# Altium project Edge_Card_Ucc28951.PrjPcb (part 2 of 3)

## Sheet MCU_CAN.SchDoc
size C
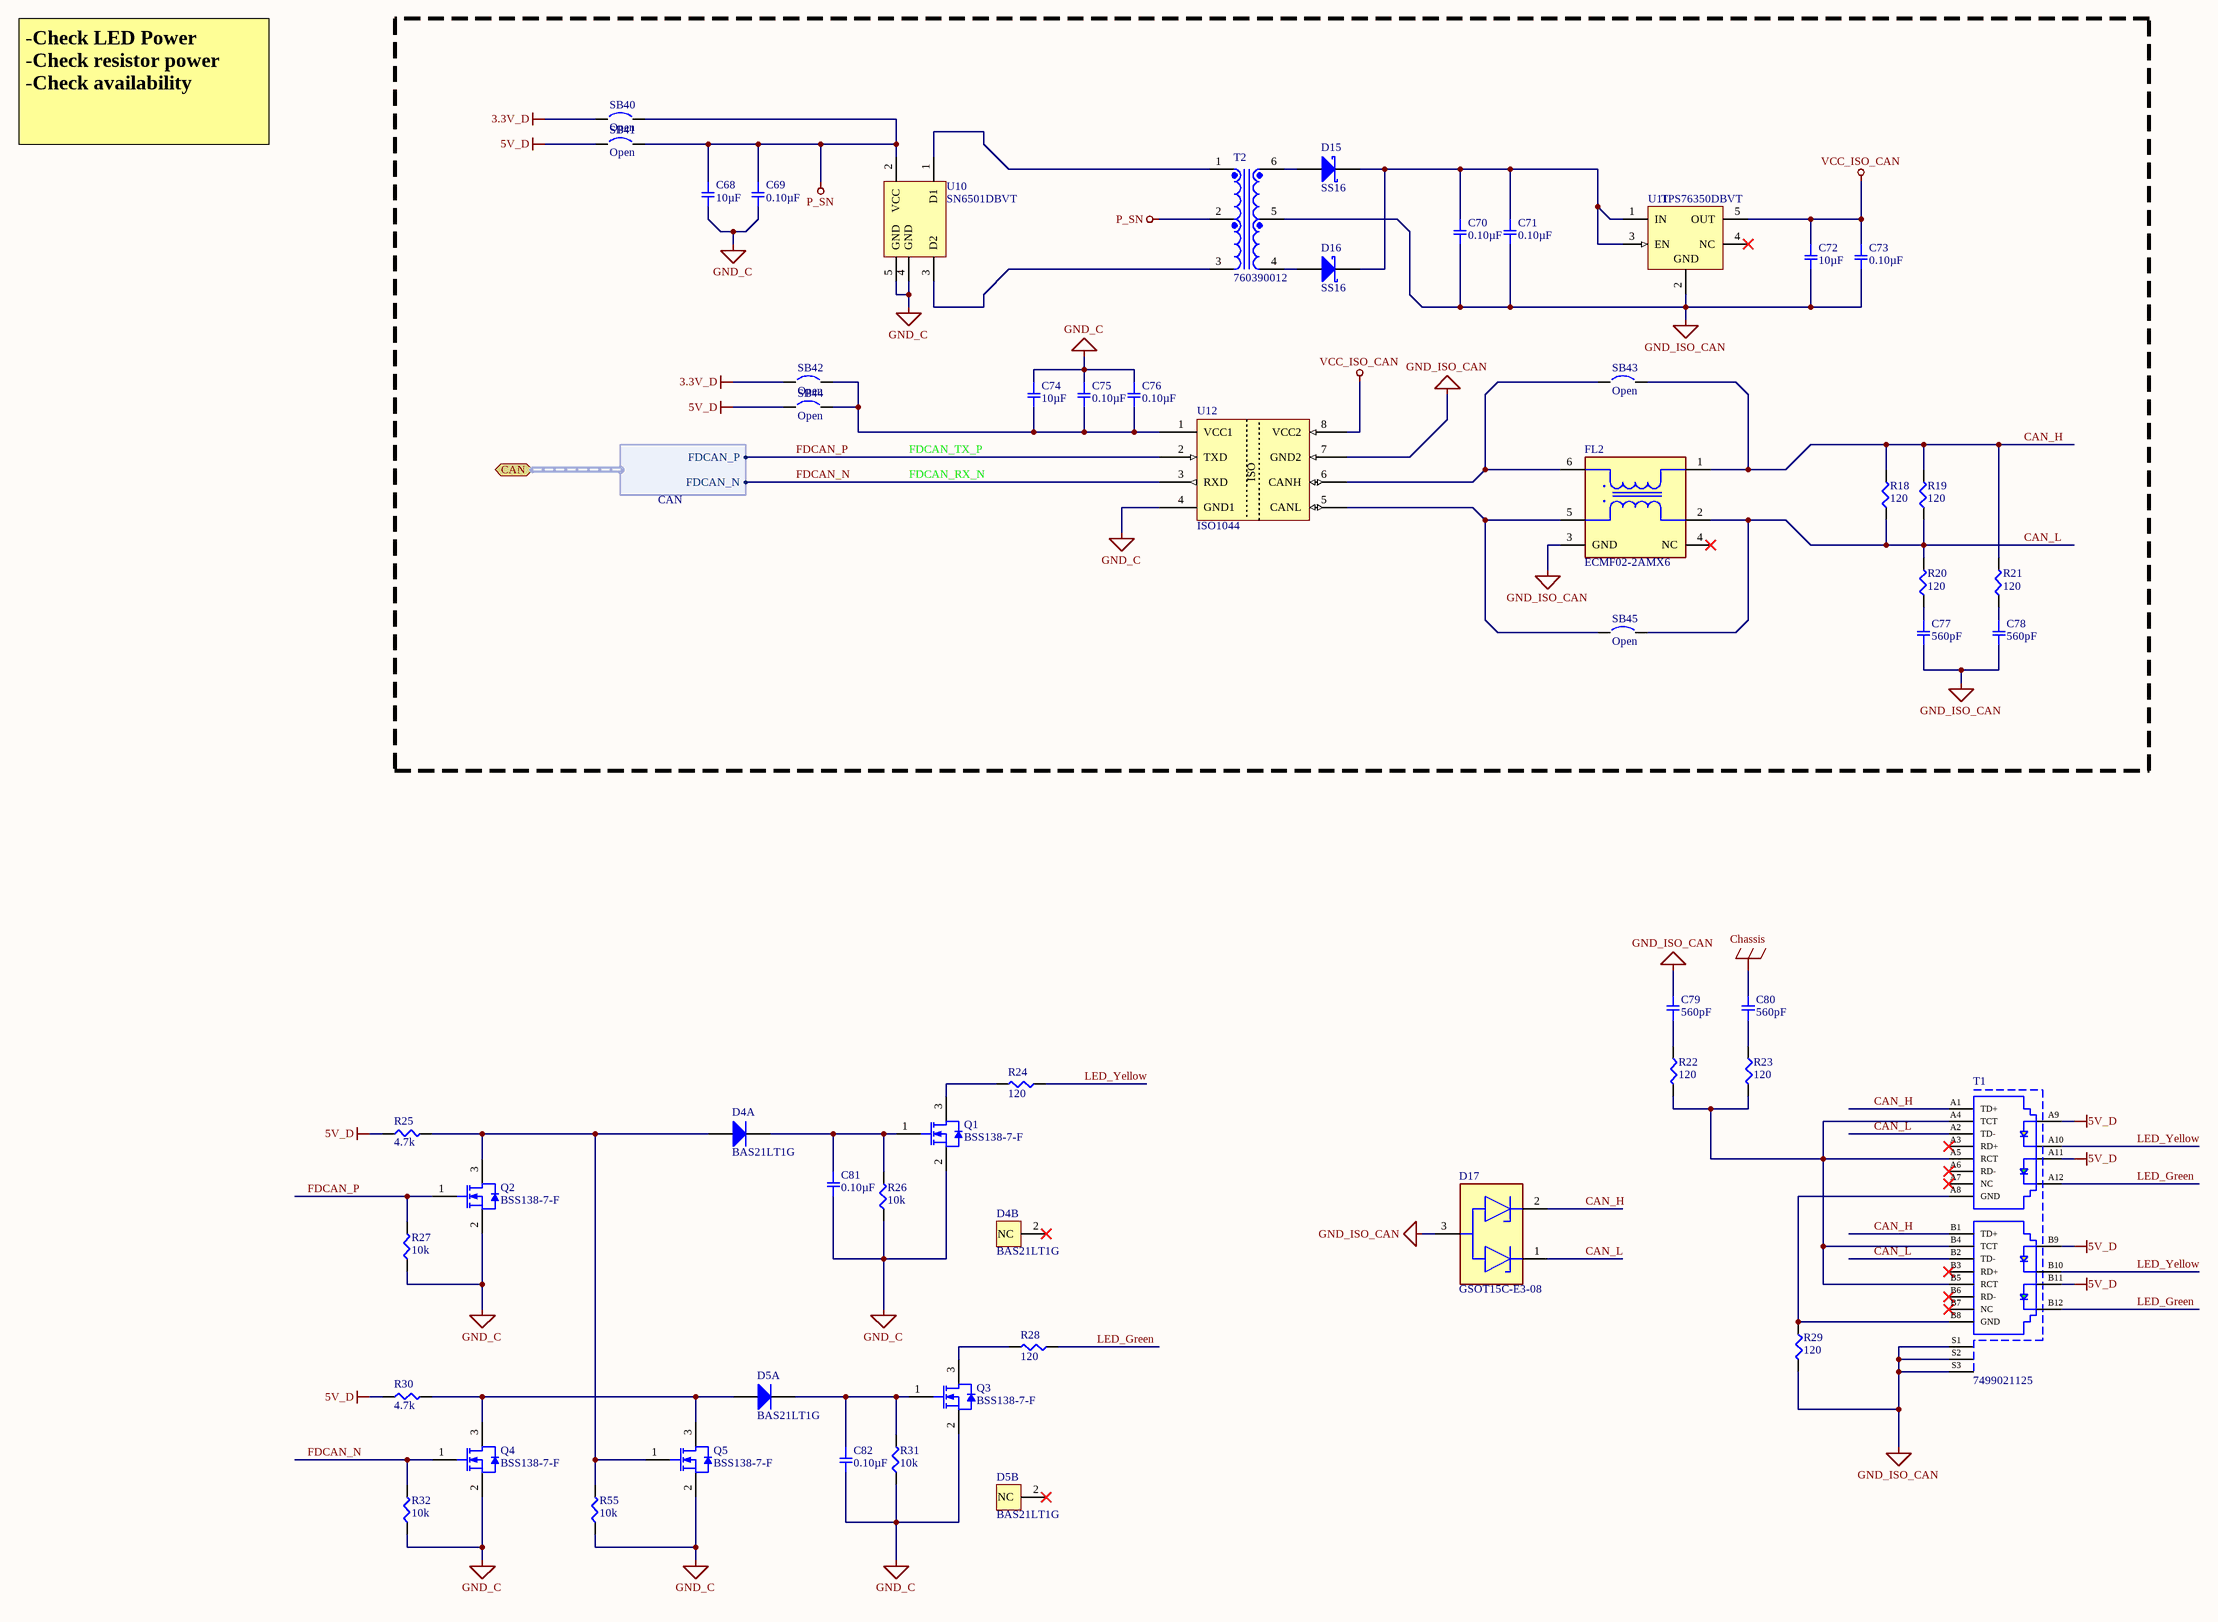
[diagram p9: MCU_CAN.SchDoc]

### Parts
C68  10µF  [SMD-0805C]
C69  0.10µF  [SMD-0805C]
C70  0.10µF  [SMD-0805C]
C71  0.10µF  [SMD-0805C]
C72  10µF  [SMD-0805C]
C73  0.10µF  [SMD-0805C]
C74  10µF  [SMD-0805C]
C75  0.10µF  [SMD-0805C]
C76  0.10µF  [SMD-0805C]
C77  560pF  [SMD-0805C]
C78  560pF  [SMD-0805C]
C79  560pF  [SMD-0805C]
C80  560pF  [SMD-0805C]
C81  0.10µF  [SMD-0805C]
C82  0.10µF  [SMD-0805C]
D4  BAS21LT1G  [ONSC-SOT-23-3-318-08_V]  (parts A,B of 2)
D5  BAS21LT1G  [ONSC-SOT-23-3-318-08_V]  (parts A,B of 2)
D15  SS16  [FAIR-SMA-2_B_V]
D16  SS16  [FAIR-SMA-2_B_V]
D17  GSOT15C-E3-08  [FP-6_541-5014_01-4-MFG]
FL2  ECMF02-2AMX6  [FP-QFN-6L-MFG]
Q1  BSS138-7-F  [DIOD-SOT23-3_V]
Q2  BSS138-7-F  [DIOD-SOT23-3_V]
Q3  BSS138-7-F  [DIOD-SOT23-3_V]
Q4  BSS138-7-F  [DIOD-SOT23-3_V]
Q5  BSS138-7-F  [DIOD-SOT23-3_V]
R18  120  [SMD-0603-RES]
R19  120  [SMD-0603-RES]
R20  120  [SMD-0603-RES]
R21  120  [SMD-0603-RES]
R22  120  [SMD-0603-RES]
R23  120  [SMD-0603-RES]
R24  120  [SMD-0603-RES]
R25  4.7k  [SMD-0603-RES]
R26  10k  [SMD-0603-RES]
R27  10k  [SMD-0603-RES]
R28  120  [SMD-0603-RES]
R29  120  [SMD-0603-RES]
R30  4.7k  [SMD-0603-RES]
R31  10k  [SMD-0603-RES]
R32  10k  [SMD-0603-RES]
R55  10k  [SMD-0603-RES]
SB40  Open  [SB_0603]  (no BOM)
SB41  Open  [SB_0603]  (no BOM)
SB42  Open  [SB_0603]  (no BOM)
SB43  Open  [SB_0603]  (no BOM)
SB44  Open  [SB_0603]  (no BOM)
SB45  Open  [SB_0603]  (no BOM)
T1  7499021125  [7499021125]
T2  760390012  [WE-760390012-6_V]
U10  SN6501DBVT  [SOT95P278X110-5N]
U11  TPS76350DBVT  [DBV0005A_M]
U12  ISO1044  [SOIC127P570X175_HS-9N - No Thermal]

### Ports
CAN (bidir, harness CAN)

### Harnesses
CAN: FDCAN_P, FDCAN_N

### Nets
3.3V_D: SB40.1 SB42.1
5V_D: R25.1 R30.1 SB41.1 SB44.1 T1.A9 T1.A11 T1.B9 T1.B11
Chassis: C80.2
GND_C: C68.2 C69.2 C74.1 C75.1 C76.1 C81.2 C82.2 Q1.2(S) Q2.2(S) Q3.2(S) Q4.2(S) Q5.2(S) R26.1 R27.1 R31.1 R32.1 R55.1 U10.4(GND) U10.5(GND) U12.4(GND1)
GND_ISO_CAN: C70.2 C71.2 C72.2 C73.2 C77.2 C78.2 C79.2 D17.3(COMMON_ANODE) FL2.3(GND) R29.2 T1.S1(Shield) T1.S2(Shield) T1.S3(Shield) T2.5 U11.2(GND) U12.7(GND2)
P_SN: C68.1 C69.1 SB40.2 SB41.2 T2.2 U10.2(VCC)
VCC_ISO_CAN: C72.1 C73.1 U11.5(OUT) U12.8(VCC2)
CAN_H: D17.2(2_CATHODE) FL2.1(D+) R18.2 R19.2 R21.2 SB43.2 T1.A1(TD+) T1.B1(TD+)
CAN_L: D17.1(1_CATHODE) FL2.2(D-) R18.1 R19.1 R20.2 SB45.2 T1.A2(TD-) T1.B2(TD-)
FDCAN_N: Q4.1(G) R32.2 U12.3(RXD) ; port CAN.FDCAN_N
FDCAN_P: Q2.1(G) R27.2 U12.2(TXD) ; port CAN.FDCAN_P
LED_Green: R28.1 T1.A12 T1.B12
LED_Yellow: R24.1 T1.A10 T1.B10
NetC70_1: C70.1 C71.1 D15.2(K) D16.2(K) U11.1(IN) U11.3(EN)
NetC74_2: C74.2 C75.2 C76.2 SB42.2 SB44.2 U12.1(VCC1)
NetC77_1: C77.1 R20.1
NetC78_1: C78.1 R21.1
NetC79_1: C79.1 R22.1
NetC80_1: C80.1 R23.1
NetC81_1: C81.1 D4.3(K) Q1.1(G) R26.2
NetC82_1: C82.1 D5.3(K) Q3.1(G) R31.2
NetD4_1: D4.1(A) Q2.3(D) Q5.1(G) R25.2 R55.2
NetD5_1: D5.1(A) Q4.3(D) Q5.3(D) R30.2
NetD15_1: D15.1(A) T2.6
NetD16_1: D16.1(A) T2.4
NetFL2_5: FL2.5(D-) SB45.1 U12.5(CANL)
NetFL2_6: FL2.6(D+) SB43.1 U12.6(CANH)
NetQ1_3: Q1.3(D) R24.2
NetQ3_3: Q3.3(D) R28.2
NetR22_2: R22.2 R23.2 T1.A4(TCT) T1.A5(RCT) T1.B4(TCT) T1.B5(RCT)
NetR29_1: R29.1 T1.A8(GND) T1.B8(GND)
NetT2_1: T2.1 U10.1(D1)
NetT2_3: T2.3 U10.3(D2)

Not connected (* = marked no-connect by the designer): D4 2(NC)*; D5 2(NC)*; FL2 4(NC)*; T1 A3(RD+)* A6(RD-)* A7(NC)* B3(RD+)* B6(RD-)* B7(NC)*; U11 4(NC)*

### Notes on the sheet
- -Check LED Power                                 -Check resistor power                             -Check availability
- FDCAN_RX_N
- FDCAN_TX_P
- (in symbol ISO1044) ISO

### Library data of the parts
C68 C72 C74 = GCM21BR71A106KE22L: CAP CER 10UF 10V X7R 0805; Manufacturer: Murata Electronics North America; Factory Stock: 0; Unit Price (USD): 0.49; Minimum Quantity: 1; Tolerance: ±10%; Datasheets: http://www.murata.com/~/media/webrenewal/support/library/catalog/products/capacitor/mlcc/c03e.ashx; Image: //media.digikey.com/photos/Murata%20Photos/NCP,GCM%20SERIES%200805.jpg; Digi-Key Part Number: 490-10674-1-ND; Part Number: GCM21BR71A106KE22L; Quantity Available: 125344; @ qty: 0; Packaging: Cut Tape (CT); Series: GCM; Part Status: Active; Value: 10µF; Voltage: 10V; Temperature Coefficient: X7R; Operating Temperature: -55°C ~ 125°C; Features: -; Ratings: AEC-Q200; Applications: Automotive; Mounting Type: Surface Mount, MLCC; Package / Case: 0805 (2012 Metric); Size / Dimension: 0.079" L x 0.049" W (2.00mm x 1.25mm); Height - Seated (Max): -; Thickness (Max): 0.055" (1.40mm); Lead Spacing: -; Lead Style: -
C69-C71 C73 C75 C76 C81 C82 = GCJ21BR72A104KA01L: CAP CER 0.1UF 100V X7R 0805; Manufacturer: Murata Electronics North America; Factory Stock: 0; Unit Price (USD): 0.32; Minimum Quantity: 1; Tolerance: ±10%; Datasheets: http://www.murata.com/~/media/webrenewal/support/library/catalog/products/capacitor/mlcc/c03e.ashx; Image: //media.digikey.com/Renders/Murata%20Renders/0805%20(2012%20Metric)%20.85mm.jpg; Digi-Key Part Number: 490-5825-1-ND; Part Number: GCJ21BR72A104KA01L; Quantity Available: 1873; @ qty: 0; Packaging: Cut Tape (CT); Series: GCJ; Part Status: Active; Value: 0.10µF; Voltage: 100V; Temperature Coefficient: X7R; Operating Temperature: -55°C ~ 125°C; Features: Soft Termination; Ratings: AEC-Q200; Applications: Automotive, Boardflex Sensitive; Mounting Type: Surface Mount, MLCC; Package / Case: 0805 (2012 Metric); Size / Dimension: 0.079" L x 0.049" W (2.00mm x 1.25mm); Height - Seated (Max): -; Thickness (Max): 0.049" (1.25mm); Lead Spacing: -; Lead Style: -
C77-C80 = GRM216R71H561KA01D: CAP CER 560PF 50V X7R 0805; Manufacturer: Murata Electronics North America; Factory Stock: 0; Unit Price (USD): 0.12; Minimum Quantity: 1; Tolerance: ±10%; Datasheets: http://www.murata.com/~/media/webrenewal/support/library/catalog/products/capacitor/mlcc/c02e.pdf; Image: //media.digikey.com/Renders/Murata%20Renders/0805%20(2012%20Metric)%20.85mm.jpg; Digi-Key Part Number: 490-11575-1-ND; Part Number: GRM216R71H561KA01D; Quantity Available: 7711; @ qty: 0; Packaging: Cut Tape (CT); Series: GRM; Part Status: Active; Value: 560pF; Voltage: 50V; Temperature Coefficient: X7R; Operating Temperature: -55°C ~ 125°C; Features: -; Ratings: -; Applications: General Purpose; Mounting Type: Surface Mount, MLCC; Package / Case: 0805 (2012 Metric); Size / Dimension: 0.079" L x 0.049" W (2.00mm x 1.25mm); Height - Seated (Max): -; Thickness (Max): 0.028" (0.70mm); Lead Spacing: -; Lead Style: -
D4 D5 = CMP-1679-00004-5: High Voltage Switching Diode, 250 V, 3-Pin SOT-23 (318-08), Pb-Free, Tape and Reel; Manufacturer: ON Semiconductor; ComponentLink1Description: Manufacturer URL; Mounting Technology: Surface Mount; ComponentLink2Description: Datasheet; PackageVersion: Rev. AP, 11/2009; ComponentLink3URL: http://www.onsemi.cn/pub_link/Collateral/318-08.PDF; Min Operating Temperature: -65 degC; DatasheetVersion: Rev. 16, 03/2014; RoHSCompliant: true; Max Operating Temperature: 150 degC; ComponentLink3Description: Package Specification; Packaging: Tape and Reel; Mount: Surface Mount; PackageDescription: 3-Pin Small Outline Transistor, Body 2.9 x 1.3 mm, Pitch 0.95 mm; PackageReference: SOT-23 (318-08); ComponentLink1URL: http://www.onsemi.com/; ComponentLink2URL: http://www.onsemi.com/pub_link/Collateral/BAS19LT1-D.PDF
D15 D16 = CMP-2000-07149-1: Schottky Rectifier, 700 mV, -65 to 125 degC, 2-Pin SMA, RoHS, Tape and Reel; Manufacturer: FairchildSemiconductor; Type: SchottkyDiode; Peak Average Forward Current: 1@Ta=75CA; Peak Reverse Current: 200uA; Peak Non-Repetitive Surge Current: 40A; Configuration: Single; Peak Forward Voltage: 0.7V; Peak Reverse Repetitive Voltage: 60V; Package: 2DO-214AC; Datasheet URL: http://www.mouser.com/ds/2/149/SS16-196707.pdf; Package Description: 2-Pin Surface Mount Device, Body 4.375 x 2.725 mm; Packaging: Tape&Reel; Package Reference: SMA-2; Mounting: SurfaceMount; Operating Temperature: -65to125°C; Datasheet Version: Rev. 1.9, 01/2015; Mounting Technology: SurfaceMount; Category: Rectifier; Manufacturer URL: https://www.fairchildsemi.com/
D17 = CMP-02577-000002-1: TVS DIODE 15V 28.8V SOT23-3; Manufacturer: Vishay; Peak Pulse Power: 345W; Automotive Grade: Grade 0; Max Junction Temp: +150°C; Value: 35pF; Breakdown Voltage: 16.5V; Peak Pulse Current: 8A; Number Of Channels: 2; Clamping Voltage: 24.8V; Direction: Unidirectional; Category: Diode; Device Class L3: unset; ComponentLink2URL: http://www.vishay.com/docs/85824/gsot03c.pdf; Lead Free: Yes; Reverse Standoff Voltage: 15V; Mouser Description: GSOT15C Series 12.3 V 120 pF SMT Bi-Directional ESD Protection Diode - SOT-23; Height: 1.15mm; Temperature Range High: +150°C; Automotive: Yes; RoHS: TRUE; ComponentLink2Description: Datasheet; Capacitance: 35pF; Device Class L1: Circuit Protection; Manufacturer Part Number: GSOT15C-E3-08; Package: 6.541-5014.01-4; Octopart: https://octopart.com/gsot15c-e3-08-vishay-46467627; Device Class L2: TVS Diodes; Temperature: -55°C to +150°C; Temperature Range Low: -55°C; Digikey Description: TVS DIODE 15V 28.8V SOT23-3
FL2 = CMP-12075-000001-1: CMC 200MA 2LN SMD ESD; Manufacturer: STMicroelectronics; Standoff Height: 0mm; Max Junction Temp: +125°C; Series Resistance: 2.5Ω; Device Class L2: EMI / RFI Components; Device Class L1: Passive Components; Height: 0.55mm; Lead Free: Yes; Package: QFN-6L; Temperature Range Low: -55°C; Octopart: https://octopart.com/ecmf02-2amx6-stmicroelectronics-44353078; Mouser Description: TVS Diodes / ESD Suppressors ESD Mode Filter 6GHz USB 2.0 MIPI 8kV; Device Class L3: Common Mode Chokes; ComponentLink2URL: https://www.st.com/resource/en/datasheet/ecmf02-2amx6.pdf; Ipc Land Pattern Name: DFN170X150X50-6; ComponentLink2Description: Datasheet; Automotive: No; Temperature Range High: +125°C; Temperature: -55°C to +125°C; RoHS: TRUE; Digikey Description: CMC 200MA 2LN SMD ESD; Manufacturer Part Number: ECMF02-2AMX6; Category: Filter
Q1-Q5 = CMP-2000-04930-1: N-Channel Enhancement Mode Mosfet, 50 V, 0.2 A, -55 to 150 degC, 3-Pin SOT23, RoHS, Tape and Reel; Manufacturer: Diodes Inc; Brand: DiodesIncorporated; Unit Weight: 0.000282oz; Pd - Power Dissipation: 300mW; Id - Continuous Drain Current: 200mA; Rds On - Drain-Source Resistance: 3.5Ohms; Vgs - Gate-Source Voltage: 20V; Number of Channels: 1Channel; Vds - Drain-Source Breakdown Voltage: 50V; Transistor Type: 1N-Channel; Typical Turn-Off Delay Time: 20ns; Configuration: Single; Mounting Style: SMD/SMT; Height: 1mm; Package Description: 3-Pin Small Outline Transistor, Body 2.9 x 1.3 mm, Pitch 0.96 mm; Datasheet Version: Rev. 20-2, 11/2013; Minimum Operating Temperature: -55C; Package / Case: SOT-23-3; Channel Mode: Enhancement; Product: MOSFETSmallSignal; Packaging: Reel; Maximum Operating Temperature: +150C; Datasheet URL: https://datasheet.ciiva.com/8115/ds30144-8115344.pdf; Product Category: MOSFET; Width: 1.3mm; Technology: Si; Package Reference: SOT23-3; Manufacturer URL: http://www.diodes.com/; Transistor Polarity: N-Channel; Length: 2.9mm; Factory Pack Quantity: 3000; Series: BSS138; RoHS: True; Typical Turn-On Delay Time: 20ns
R18-R24 R28 R29 = ERJ-3EKF1200V: RES SMD 120 OHM 1% 1/10W 0603; Manufacturer: Panasonic Electronic Components; Factory Stock: 0; Unit Price (USD): 0.00379; @ qty: 1500; Minimum Quantity: 1; Power (Watts): 0.1W, 1/10W; Temperature Coefficient: ±100ppm/°C; Part Number: ERJ-3EKF1200V; Datasheets: http://industrial.panasonic.com/www-cgi/jvcr13pz.cgi?E+PZ+3+AOA0002+ERJ3EKF1200V+7+WW; Image: //media.digikey.com/Photos/Panasonic%20Photos/MFG_ERJ-P6W%20Series.jpg; Digi-Key Part Number: P120HCT-ND; Quantity Available: 84623; Packaging: Cut Tape (CT); Series: ERJ; Part Status: Active; Value: 120; Tolerance: ±1%; Composition: Thick Film; Features: Automotive AEC-Q200; Operating Temperature: -55°C ~ 155°C; Package / Case: 0603 (1608 Metric); Supplier Device Package: 0603; Size / Dimension: 0.063" L x 0.031" W (1.60mm x 0.80mm); Height - Seated (Max): 0.022" (0.55mm); Number of Terminations: 2; Failure Rate: -
R25 R30 = ERJ-3EKF4701V: RES SMD 4.7K OHM 1% 1/10W 0603; Manufacturer: Panasonic Electronic Components; Factory Stock: 0; Unit Price (USD): 0.00379; @ qty: 1500; Minimum Quantity: 1; Power (Watts): 0.1W, 1/10W; Temperature Coefficient: ±100ppm/°C; Part Number: ERJ-3EKF4701V; Datasheets: http://industrial.panasonic.com/www-cgi/jvcr13pz.cgi?E+PZ+3+AOA0002+ERJ3EKF4701V+7+WW; Image: //media.digikey.com/Photos/Panasonic%20Photos/MFG_ERJ-P6W%20Series.jpg; Digi-Key Part Number: P4.70KHCT-ND; Quantity Available: 999380; Packaging: Cut Tape (CT); Series: ERJ; Part Status: Active; Value: 4.7k; Tolerance: ±1%; Composition: Thick Film; Features: Automotive AEC-Q200; Operating Temperature: -55°C ~ 155°C; Package / Case: 0603 (1608 Metric); Supplier Device Package: 0603; Size / Dimension: 0.063" L x 0.031" W (1.60mm x 0.80mm); Height - Seated (Max): 0.022" (0.55mm); Number of Terminations: 2; Failure Rate: -
R26 R27 R31 R32 R55 = ERJ-3EKF1002V: RES SMD 10K OHM 1% 1/10W 0603; Manufacturer: Panasonic Electronic Components; Factory Stock: 0; Unit Price (USD): 0.00379; @ qty: 1500; Minimum Quantity: 1; Power (Watts): 0.1W, 1/10W; Temperature Coefficient: ±100ppm/°C; Part Number: ERJ-3EKF1002V; Datasheets: http://industrial.panasonic.com/www-cgi/jvcr13pz.cgi?E+PZ+3+AOA0002+ERJ3EKF1002V+7+WW; Image: //media.digikey.com/Photos/Panasonic%20Photos/MFG_ERJ-P6W%20Series.jpg; Digi-Key Part Number: P10.0KHCT-ND; Quantity Available: 6703141; Packaging: Cut Tape (CT); Series: ERJ; Part Status: Active; Value: 10k; Tolerance: ±1%; Composition: Thick Film; Features: Automotive AEC-Q200; Operating Temperature: -55°C ~ 155°C; Package / Case: 0603 (1608 Metric); Supplier Device Package: 0603; Size / Dimension: 0.063" L x 0.031" W (1.60mm x 0.80mm); Height - Seated (Max): 0.022" (0.55mm); Number of Terminations: 2; Failure Rate: -
SB40-SB45 = Solder Bridge: Circuit Breaker; Published: 24-Mar-1999; Revision: July-2002: Re-released for DXP Platform.; Publisher: Altium Limited
T1 = 7499021125: WE-RJ45 LAN Transformer, THT, 10/100 Base-T, Port 1x2, Tab Down; PoE: non-PoE; LED: yellow-green; USB: No; Shield Tabs: Yes; ComponentLink1Description: Manufacturer; ComponentLink1URL: http://www.we-online.de; ComponentLink2Description: Datasheet; ComponentLink2URL: https://katalog.we-online.com/pbs/datasheet/7499021125.pdf; Part Number: 7499021125; Published Date: July 2019; Publisher: Wurth Elektronik; Tab: Down; Port Number: 1x2; Data Rate: 10/100 Base-T; Operating Temperature: 0 to +70degC; Mounting Technology: THT; Packaging: Tube
T2 = 760039112: Transformer, 150 mA, -40 to 125 degC, 6-Pin SMD, RoHS, Tape and Reel; Manufacturer: Wuerth Elektronik; Mounting Technology: SurfaceMount; Manufacturer URL: https://www.we-online.com/; Datasheet Version: Rev. 6C, 06/2013; Datasheet URL: https://datasheet.ciiva.com/12335/760390012-221167-12335394.pdf; Package Description: 6-Pin Surface Mount Device, Body 7.14 x 6.73 mm, Pitch 2.54 mm; Package Reference: 7060390012-6
U10 = SN6501: Transformer Driver for Isolated Power Supplies, 0.15 to 0.35 A, 3 to 5.5 V, -40 to 125 degC, 5-Pin SOT-23 (DBV), Green (RoHS & no Sb/Br), Tape and Reel; Manufacturer: TexasInstruments; Package Version: 4073253-4/N, 12/2014; Minimum Input Voltage: 3V; Switching Frequency: 300to620kHz; Output Voltage: 0to11V; Number of Outputs: 1; Maximum Input Voltage: 5.5V; Maximum Output Current: 0.35A; Type: Non-Inverting|Inverting|StepUp|StepDown; Package: 5SOT-23; Package URL: http://www.ti.com/lit/ml/mpds018l/mpds018l.pdf; Category: DCtoDCConverter; Package Reference: DBV5; Datasheet Version: Rev. G, 09/2014; Packaging: Tape&Reel; Operating Temperature: -40to125°C; Manufacturer URL: http://www.ti.com/; Mounting: SurfaceMount; Rad Hard: No; Package Description: 5-Pin Small Outline Transistor, Body 2.9 x 1.6 mm, Pitch 0.95 mm; Datasheet URL: http://www.ti.com/lit/ds/symlink/sn6501.pdf; Mounting Technology: SurfaceMount
U11 = CMP-0394-00604-2: Single Output LDO, 150 mA, Fixed 5 V Output, 2.7 to 10 V Input, with Low IQ, 5-pin SOT-23 (DBV), -40 to 125 degC, Green (RoHS & no Sb/Br); Manufacturer: Texas Instruments; Accuracy(%): 3; Iout(Max)(A): 0.15; Vin(Min)(V): 2.7; SubFamily: Single Channel LDO; Iq(Typ)(mA): 0.08; Vin(Max)(V): 10; Vout Adj(Min)(V): 5; Vdo(Typ)(mV): 300; PartNumber: TPS76350DBVT; Mounting Technology: Surface Mount; PackageDescription: 5-Pin Plastic Small Outline, Body 1.60 Ãƒâ€” 2.90 mm, Pitch 0.95 mm; ComponentLink2Description: Datasheet; ComponentLink2URL: http://www.ti.com/general/docs/lit/getliterature.tsp?genericPartNumber=TPS76350&fileType=pdf; Code_JEDEC: MO-178; PackageReference: DBV0005A; ComponentLink1Description: Manufacturer URL; Eco-Plan: Green (RoHS & no Sb/Br); ComponentLink3URL: http://www.ti.com/litv/pdf/mpds018i; Fixed Output Options(V): 5; ComponentLink1URL: http://www.ti.com/; DatasheetVersion: SLVS181H; ComponentLink3Description: Package Specification; Vout Adj(Max)(V): 5; PackageVersion: 4073253-4/K
U12 = ISO1044: Isolated FD CAN Transreciever

## Sheet Power.SchDoc
size C
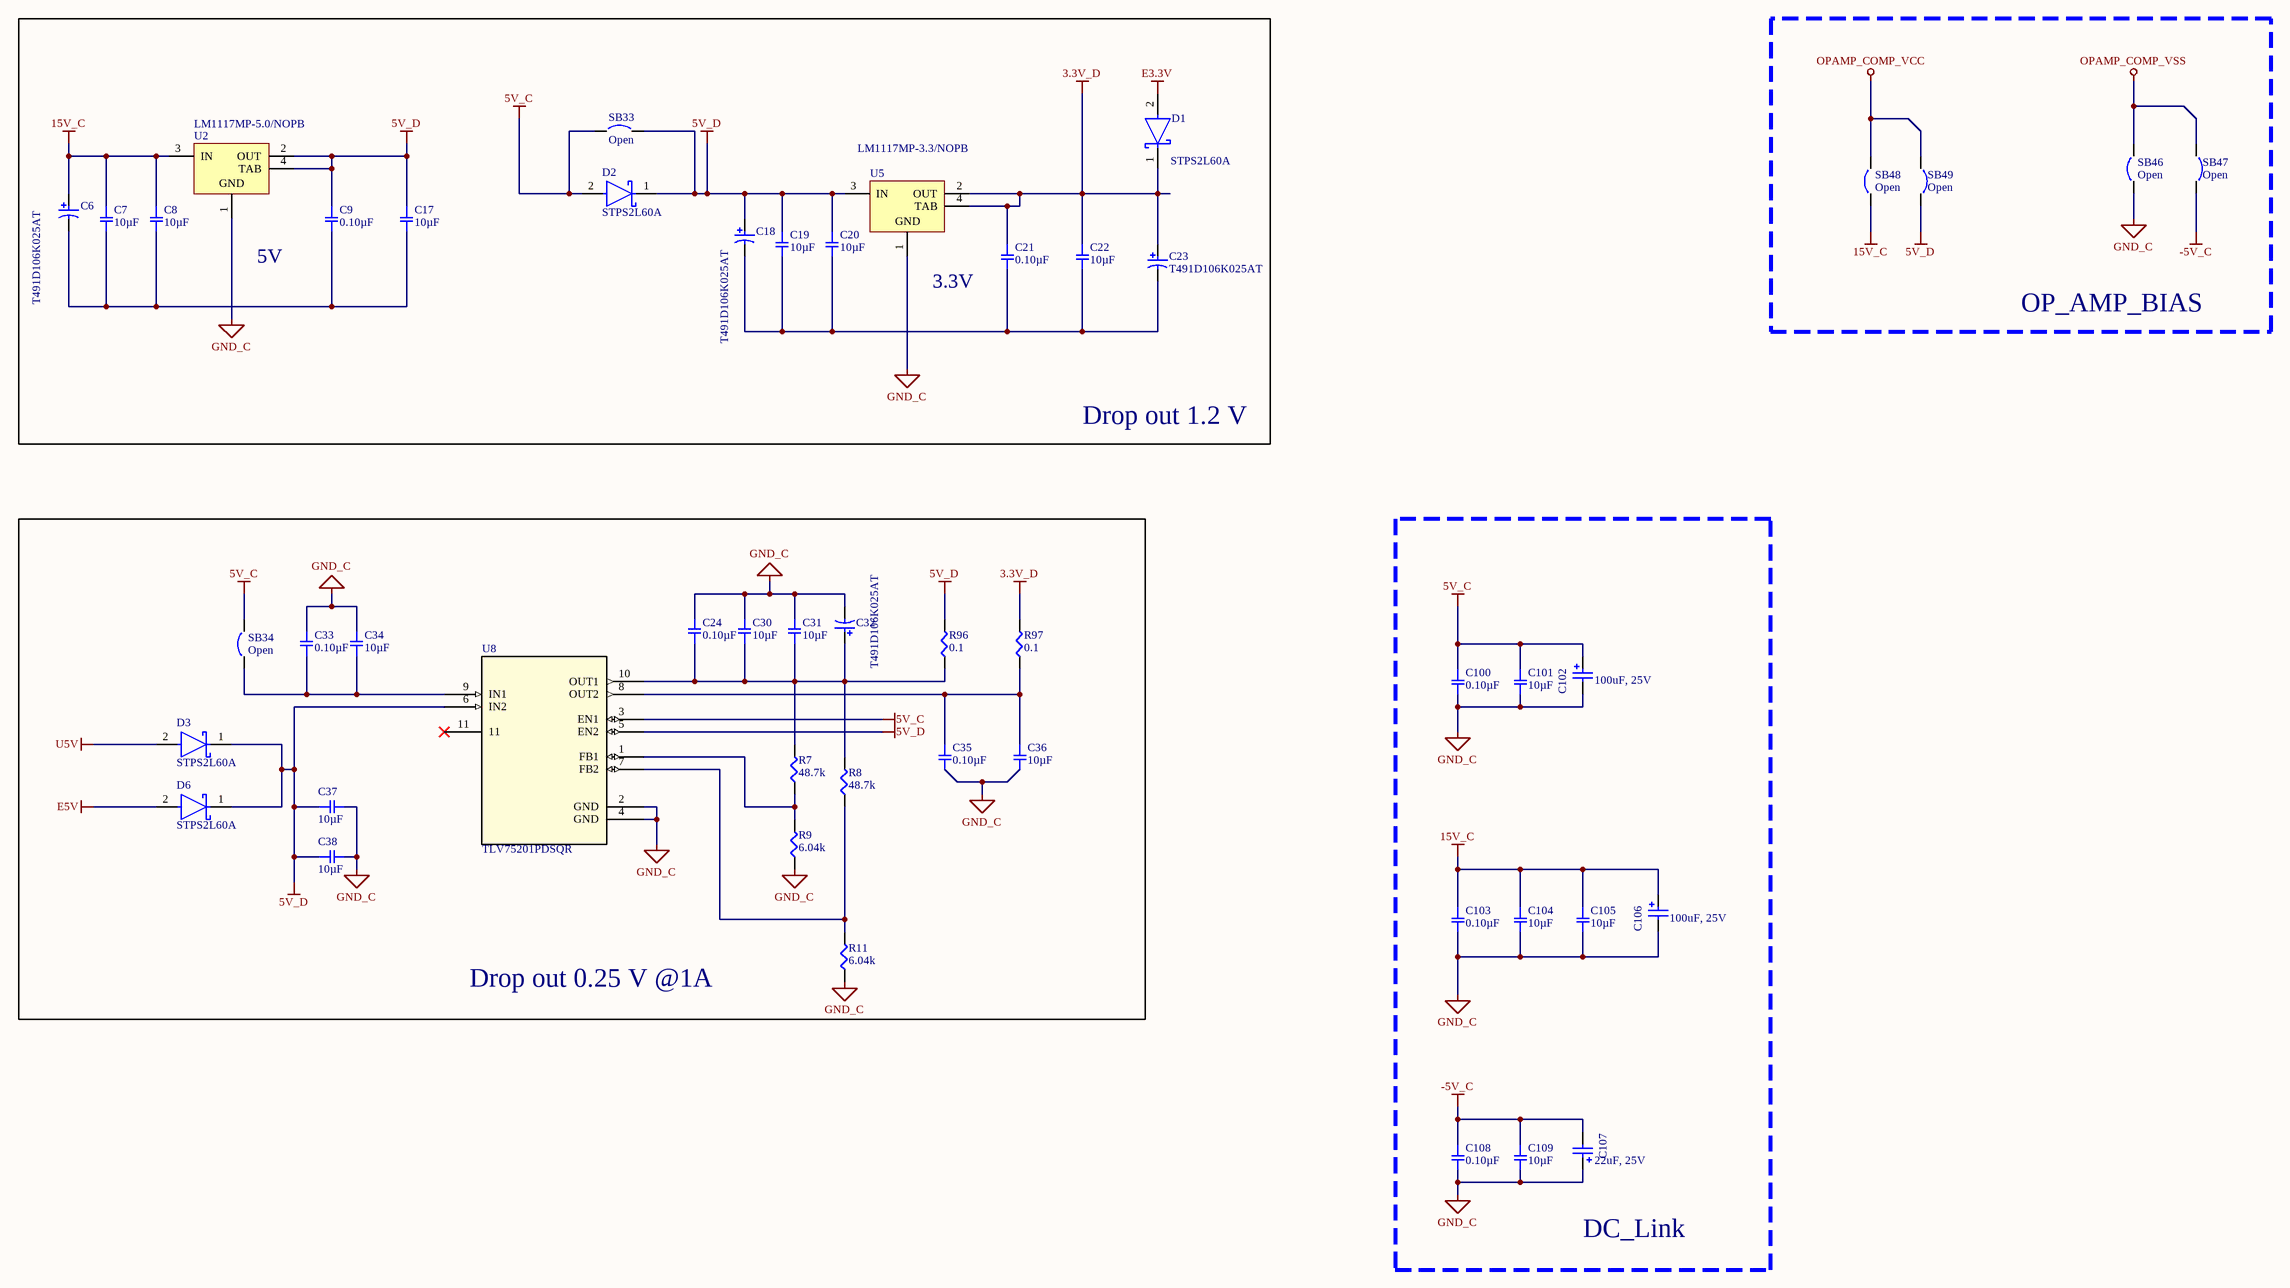
[diagram p10: Power.SchDoc]

### Parts
C6  T491D106K025AT  [KEMT-T491-D_L]
C7  10µF  [SMD-0805C]
C8  10µF  [SMD-0805C]
C9  0.10µF  [SMD-0805C]
C17  10µF  [SMD-0805C]
C18  T491D106K025AT  [KEMT-T491-D_L]
C19  10µF  [SMD-0805C]
C20  10µF  [SMD-0805C]
C21  0.10µF  [SMD-0805C]
C22  10µF  [SMD-0805C]
C23  T491D106K025AT  [KEMT-T491-D_L]
C24  0.10µF  [SMD-0805C]
C30  10µF  [SMD-0805C]
C31  10µF  [SMD-0805C]
C32  T491D106K025AT  [KEMT-T491-D_L]
C33  0.10µF  [SMD-0805C]
C34  10µF  [SMD-0805C]
C35  0.10µF  [SMD-0805C]
C36  10µF  [SMD-0805C]
C37  10µF  [SMD-0805C]
C38  10µF  [SMD-0805C]
C100  0.10µF  [SMD-0805C]
C101  10µF  [SMD-0805C]
C102  100uF, 25V  [WCAP-ASLU_6.3x7.7]
C103  0.10µF  [SMD-0805C]
C104  10µF  [SMD-0805C]
C105  10µF  [SMD-0805C]
C106  100uF, 25V  [WCAP-ASLU_6.3x7.7]
C107  22uF, 25V  [WCAP-ASLU_5x5.5]
C108  0.10µF  [SMD-0805C]
C109  10µF  [SMD-0805C]
D1  STPS2L60A  [FP-SMA-MFG]
D2  STPS2L60A  [FP-SMA-MFG]
D3  STPS2L60A  [FP-SMA-MFG]
D6  STPS2L60A  [FP-SMA-MFG]
R7  48.7k  [SMD-0603-RES]
R8  48.7k  [SMD-0603-RES]
R9  6.04k  [SMD-0603-RES]
R11  6.04k  [SMD-0603-RES]
R96  0.1  [SMD-1206-RES]
R97  0.1  [SMD-1206-RES]
SB33  Open  [SB_0603]  (no BOM)
SB34  Open  [SB_0603]  (no BOM)
SB46  Open  [Solder Bridge - HP]  (no BOM)
SB47  Open  [Solder Bridge - HP]  (no BOM)
SB48  Open  [Solder Bridge - HP]  (no BOM)
SB49  Open  [Solder Bridge - HP]  (no BOM)
U2  LM1117MP-5.0/NOPB  [DCY0004A_N]
U5  LM1117MP-3.3/NOPB  [DCY0004A_L]
U8  TLV75201PDSQR  [SON40P200X80_HS-11N]

### Blocks framed on the sheet
Drop out 1.2 V: C6-C9 C17-C23 D1 D2 SB33 U2 U5
OP_AMP_BIAS: SB46-SB49
Drop out 0.25 V @1A: C24 C30-C38 D3 D6 R7-R9 R11 R96 R97 SB34 U8
DC_Link: C100-C109

### Nets
3.3V_D: C21.1 C22.1 C23.1 D1.1(K) R97.2 U5.2(OUT) U5.4(TAB)
5V_C: C100.1 C101.1 C102.2(P) D2.2(A) SB33.1 SB34.2 U8.3(EN1)
5V_D: C9.1 C17.1 C18.1 C19.1 C20.1 C37.1 C38.1 D2.1(K) D3.1(K) D6.1(K) R96.2 SB33.2 SB49.1 U2.2(OUT) U2.4(TAB) U5.3(IN) U8.5(EN2) U8.6(IN2)
15V_C: C6.1 C7.1 C8.1 C103.1 C104.1 C105.1 C106.2(P) SB48.1 U2.3(IN)
-5V_C: C107.1(N) C108.1 C109.1 SB47.1
E3.3V: D1.2(A)
E5V: D6.2(A)
GND_C: C24.2 C30.2 C31.2 C32.2 C33.2 C34.2 C35.2 C36.2 C37.2 C38.2 C100.2 C101.2 C102.1(N) C103.2 C104.2 C105.2 C106.1(N) C107.2(P) C108.2 C109.2 R9.1 R11.1 SB46.1 U2.1(GND) U5.1(GND) U8.2(GND) U8.4(GND)
OPAMP_COMP_VCC: SB48.2 SB49.2
OPAMP_COMP_VSS: SB46.2 SB47.2
U5V: D3.2(A)
NetC6_2: C6.2 C7.2 C8.2 C9.2 C17.2
NetC18_2: C18.2 C19.2 C20.2 C21.2 C22.2 C23.2
NetC24_1: C24.1 C30.1 C31.1 C32.1 R7.2 R8.2 R96.1 U8.10(OUT1)
NetC33_1: C33.1 C34.1 SB34.1 U8.9(IN1)
NetC35_1: C35.1 C36.1 R97.1 U8.8(OUT2)
NetR7_1: R7.1 R9.2 U8.1(FB1)
NetR8_1: R8.1 R11.2 U8.7(FB2)

Not connected (* = marked no-connect by the designer): U8 11*

### Notes on the sheet
- 5V
- 3.3V

### Library data of the parts
C6 C18 C23 C32 = CMP-2000-07200-1: Tantalum Capacitor, 10 uF, +/- 10%, 25 V, -55 to 125 degC, 2-Pin SMD, RoHS, Tape and Reel; Manufacturer: Kemet; Insulation: NotRequired; Rad Hardened: No; Case Style: Molded; Polarity: Polar; Product Height (mm): 2.8mm; Capacitance: 10000000pF; Product Length (mm): 7.3mm; DF: 6%; ESR: 1ohm; Product Diameter (mm): NotRequiredmm; Voltage: 25VDC; Product Depth (mm): 4.3mm; DCL: 2.5uA; Mounting Style: SurfaceMount; Construction: SMTChip; Failure Rate: NotRequired; Operating Temp Range: -55Cto125C; Packaging: TapeandReel; Length W/Weld: NotRequiredmm; Package Reference: T491-D; Datasheet Version: 10/2016; Package / Case: 7343-31; Wire Form: NotRequired; Seated Plane Height: NotRequiredmm; Length W/Weld (max): NotRequiredmm; Package Description: 2-Pin Surface Mount Device, Body 7.3 x 4.3 mm; Tolerance (+ or -): 10%; Manufacturer URL: http://www.kemet.com/; Datasheet URL: http://capacitoredge.kemet.com/capedge2/DataSheet/Datasheet-T491D106K025AT.pdf?pn=T491D106K025AT; Case Code: D; Mounting Technology: SurfaceMount; Seal: NotRequired; Lead Spacing (nom): NotRequiredmm
C7 C8 C17 C19 C20 C22 C30 C31 C34 C36-C38 C101 C104 C105 C109 = GCM21BR71A106KE22L: as C68 on sheet MCU_CAN; Datasheets: http://www.murata.com/~/media/webrenewal/support/library/catalog/products/capacitor/mlcc/c03e.ashx; Image: //media.digikey.com/photos/Murata%20Photos/NCP,GCM%20SERIES%200805.jpg; Digi-Key Part Number: 490-10674-1-ND; Part Number: GCM21BR71A106KE22L; Quantity Available: 125344; @ qty: 0; Packaging: Cut Tape (CT); Series: GCM; Part Status: Active; Value: 10µF; Voltage: 10V; Temperature Coefficient: X7R; Operating Temperature: -55°C ~ 125°C; Features: -; Ratings: AEC-Q200; Applications: Automotive; Mounting Type: Surface Mount, MLCC; Package / Case: 0805 (2012 Metric); Size / Dimension: 0.079" L x 0.049" W (2.00mm x 1.25mm); Height - Seated (Max): -; Thickness (Max): 0.055" (1.40mm); Lead Spacing: -; Lead Style: -
C9 C21 C24 C33 C35 C100 C103 C108 = GCJ21BR72A104KA01L: as C69 on sheet MCU_CAN; Datasheets: http://www.murata.com/~/media/webrenewal/support/library/catalog/products/capacitor/mlcc/c03e.ashx; Image: //media.digikey.com/Renders/Murata%20Renders/0805%20(2012%20Metric)%20.85mm.jpg; Digi-Key Part Number: 490-5825-1-ND; Part Number: GCJ21BR72A104KA01L; Quantity Available: 1873; @ qty: 0; Packaging: Cut Tape (CT); Series: GCJ; Part Status: Active; Value: 0.10µF; Voltage: 100V; Temperature Coefficient: X7R; Operating Temperature: -55°C ~ 125°C; Features: Soft Termination; Ratings: AEC-Q200; Applications: Automotive, Boardflex Sensitive; Mounting Type: Surface Mount, MLCC; Package / Case: 0805 (2012 Metric); Size / Dimension: 0.079" L x 0.049" W (2.00mm x 1.25mm); Height - Seated (Max): -; Thickness (Max): 0.049" (1.25mm); Lead Spacing: -; Lead Style: -
C102 C106 = 865090445008: WCAP-ASLU Aluminium Electrolytic Capacitors, D6.3mm x L7.7mm, 100uF, +/-20%, 25VDC; Dissipation Factor: 16%; Leakage Current: 5uA; Endurance: 1000h; Technical Reference: ASBD077101M025DVCTCA000; Ripple Current max.: 102mA; ComponentLink1Description: Manufacturer; ComponentLink1URL: http://www.we-online.de; ComponentLink2Description: Datasheet; ComponentLink2URL: https://katalog.we-online.com/pbs/datasheet/865090445008.pdf; Mounting Technology: SMD; Operating Temperature: -40 to +85degC; Packaging: Tape and Reel; Part Number: 865090445008; Publisher: Wurth Elektronik; Capacitance: 100uF; Diameter: 6.3mm; Length: 7.7mm; Published Date: August 2019; Rated Voltage: 25VDC; Capacitance Tolerance: +/-20%
C107 = 865090442004: WCAP-ASLU Aluminium Electrolytic Capacitors, D5mm x L5.5mm, 22uF, +/-20%, 25VDC; Dissipation Factor: 16%; Leakage Current: 1.1uA; Endurance: 1000h; Technical Reference: ASBC055220M025DVCTBA000; Ripple Current max.: 42mA; ComponentLink1Description: Manufacturer; ComponentLink1URL: http://www.we-online.de; ComponentLink2Description: Datasheet; ComponentLink2URL: https://katalog.we-online.com/pbs/datasheet/865090442004.pdf; Mounting Technology: SMD; Operating Temperature: -40 to +85degC; Packaging: Tape and Reel; Part Number: 865090442004; Publisher: Wurth Elektronik; Capacitance: 22uF; Diameter: 5mm; Length: 5.5mm; Published Date: August 2019; Rated Voltage: 25VDC; Capacitance Tolerance: +/-20%
D1-D3 D6 = CMP-12187-000014-1: DIODE SCHOTTKY 60V 2A SMA; Manufacturer: STMicroelectronics; Peak Reverse Current: 100uA; Max Junction Temp: +150°C; Max Surge Forward Current: 75A; Standoff Height: 0.05mm; Octopart: https://octopart.com/stps2l60a-stmicroelectronics-324283; Manufacturer Part Number: STPS2L60A; Package: SMA; Temperature Range High: +150°C; Lead Free: Yes; Digikey Description: DIODE SCHOTTKY 60V 2A SMA; Height: 2.65mm; Device Class L3: Schottky Diodes; RoHS: TRUE; ComponentLink2URL: https://www.st.com/resource/en/datasheet/stps2l60.pdf; Automotive: No; Max Repetitive Reverse Voltage: 60V; Device Class L1: Discrete Semiconductors; Category: Diode; ComponentLink2Description: Datasheet; Device Class L2: Diodes; Forward Current: 2A; Temperature: to +150°C; Mouser Description: Schottky diode Configuration: Single Housing type: DO-214AC=SMA Peak conducting-state current: 75 A
R7 R8 = ERJ-3EKF4872V: RES SMD 48.7K OHM 1% 1/10W 0603; Manufacturer: Panasonic Electronic Components; Factory Stock: 0; Unit Price (USD): 0.00379; @ qty: 1500; Minimum Quantity: 1; Power (Watts): 0.1W, 1/10W; Temperature Coefficient: ±100ppm/°C; Part Number: ERJ-3EKF4872V; Datasheets: http://industrial.panasonic.com/www-cgi/jvcr13pz.cgi?E+PZ+3+AOA0002+ERJ3EKF4872V+7+WW; Image: //media.digikey.com/Photos/Panasonic%20Photos/MFG_ERJ-P6W%20Series.jpg; Digi-Key Part Number: P48.7KHCT-ND; Quantity Available: 117361; Packaging: Cut Tape (CT); Series: ERJ; Part Status: Active; Value: 48.7k; Tolerance: ±1%; Composition: Thick Film; Features: Automotive AEC-Q200; Operating Temperature: -55°C ~ 155°C; Package / Case: 0603 (1608 Metric); Supplier Device Package: 0603; Size / Dimension: 0.063" L x 0.031" W (1.60mm x 0.80mm); Height - Seated (Max): 0.022" (0.55mm); Number of Terminations: 2; Failure Rate: -
R9 R11 = ERJ-3EKF6041V: RES SMD 6.04K OHM 1% 1/10W 0603; Manufacturer: Panasonic Electronic Components; Factory Stock: 0; Unit Price (USD): 0.00379; @ qty: 1500; Minimum Quantity: 1; Power (Watts): 0.1W, 1/10W; Temperature Coefficient: ±100ppm/°C; Part Number: ERJ-3EKF6041V; Datasheets: http://industrial.panasonic.com/www-cgi/jvcr13pz.cgi?E+PZ+3+AOA0002+ERJ3EKF6041V+7+WW; Image: //media.digikey.com/Photos/Panasonic%20Photos/MFG_ERJ-P6W%20Series.jpg; Digi-Key Part Number: P6.04KHCT-ND; Quantity Available: 391545; Packaging: Cut Tape (CT); Series: ERJ; Part Status: Active; Value: 6.04k; Tolerance: ±1%; Composition: Thick Film; Features: Automotive AEC-Q200; Operating Temperature: -55°C ~ 155°C; Package / Case: 0603 (1608 Metric); Supplier Device Package: 0603; Size / Dimension: 0.063" L x 0.031" W (1.60mm x 0.80mm); Height - Seated (Max): 0.022" (0.55mm); Number of Terminations: 2; Failure Rate: -
R96 R97 = ERJ-8BSFR10V: RES SMD 0.1 OHM 1% 1/2W 1206; Manufacturer: Panasonic Electronic Components; Factory Stock: 0; Unit Price (USD): 0.11739; @ qty: 1500; Minimum Quantity: 1; Power (Watts): 0.5W, 1/2W; Temperature Coefficient: ±250ppm/°C; Part Number: ERJ-8BSFR10V; Datasheets: https://industrial.panasonic.com/cdbs/www-data/pdf/RDA0000/AOA0000C239.pdf; Image: //media.digikey.com/Renders/Panasonic%20Renders/ERJ-1206%20Pkg.jpg; Digi-Key Part Number: P17678CT-ND; Quantity Available: 5524; Packaging: Cut Tape (CT); Series: ERJ; Part Status: Active; Value: 0.1; Tolerance: ±1%; Composition: Thick Film; Features: Automotive AEC-Q200, Current Sense; Operating Temperature: -55°C ~ 125°C; Package / Case: 1206 (3216 Metric); Supplier Device Package: 1206; Size / Dimension: 0.126" L x 0.063" W (3.20mm x 1.60mm); Height - Seated (Max): 0.028" (0.70mm); Number of Terminations: 2; Failure Rate: -
SB33 SB34 SB46-SB49 = Solder Bridge: Circuit Breaker; Published: 24-Mar-1999; Revision: July-2002: Re-released for DXP Platform.; Publisher: Altium Limited
U2 = CMP-0062-01634-4: 800mA Low-Dropout Linear Regulator, 4-pin SOT-223, Pb-Free; Manufacturer: Texas Instruments; PowerWise: N; PackageTopMarking: XYTT*N06A; CompType: LDO IC; High-Reliability: Y; Code_JEDEC: TO-261-AA; ComponentLink1Description: Datasheet URL; ComponentLink1URL: http://www.ti.com/general/docs/lit/getliterature.tsp?genericPartNumber=LM1117-N&fileType=pdf; PackageReference: DCY0004A; PartNumber: LM1117MP-5.0/NOPB; PackageDescription: Molded SOT-223, 6.50 x 3.56 x 1.6mm Body, 4 Lead, 2.3mm Pitch; RoHS: Y; Code_IPC: SOT223-4; PinCount: 4
U5 = CMP-0062-01638-4: 800mA Low-Dropout Linear Regulator, 4-pin SOT-223, Pb-Free; Manufacturer: Texas Instruments; CompType: LDO IC; PackageTopMarking: XYTT*N05A; High-Reliability: Y; PowerWise: N; ComponentLink1URL: http://www.ti.com/general/docs/lit/getliterature.tsp?genericPartNumber=LM1117-N&fileType=pdf; PinCount: 4; PackageDescription: Molded SOT-223, 6.50 x 3.56 x 1.6mm Body, 4 Lead, 2.3mm Pitch; Code_IPC: SOT223-4; PartNumber: LM1117MP-3.3/NOPB; Code_JEDEC: TO-261-AA; RoHS: Y; PackageReference: DCY0004A; ComponentLink1Description: Datasheet URL
U8 = TLV75201PDSQR: No Description Available; SourceLibrary: TI_2020-07-28; Vendor: Texas Instruments; Built_By: EMA_Matt; Datasheet: https://www.ti.com/lit/ds/symlink/tlv752.pdf; Manufacturer_Part_Number: TLV75201PDSQR; Copyright: Copyright (C) 2018 Accelerated Designs. All rights reserved; RefDes: RefDes; Type: DEV